# Altium schematic sheet WX0.010.982DL(1).SchDoc
size A3
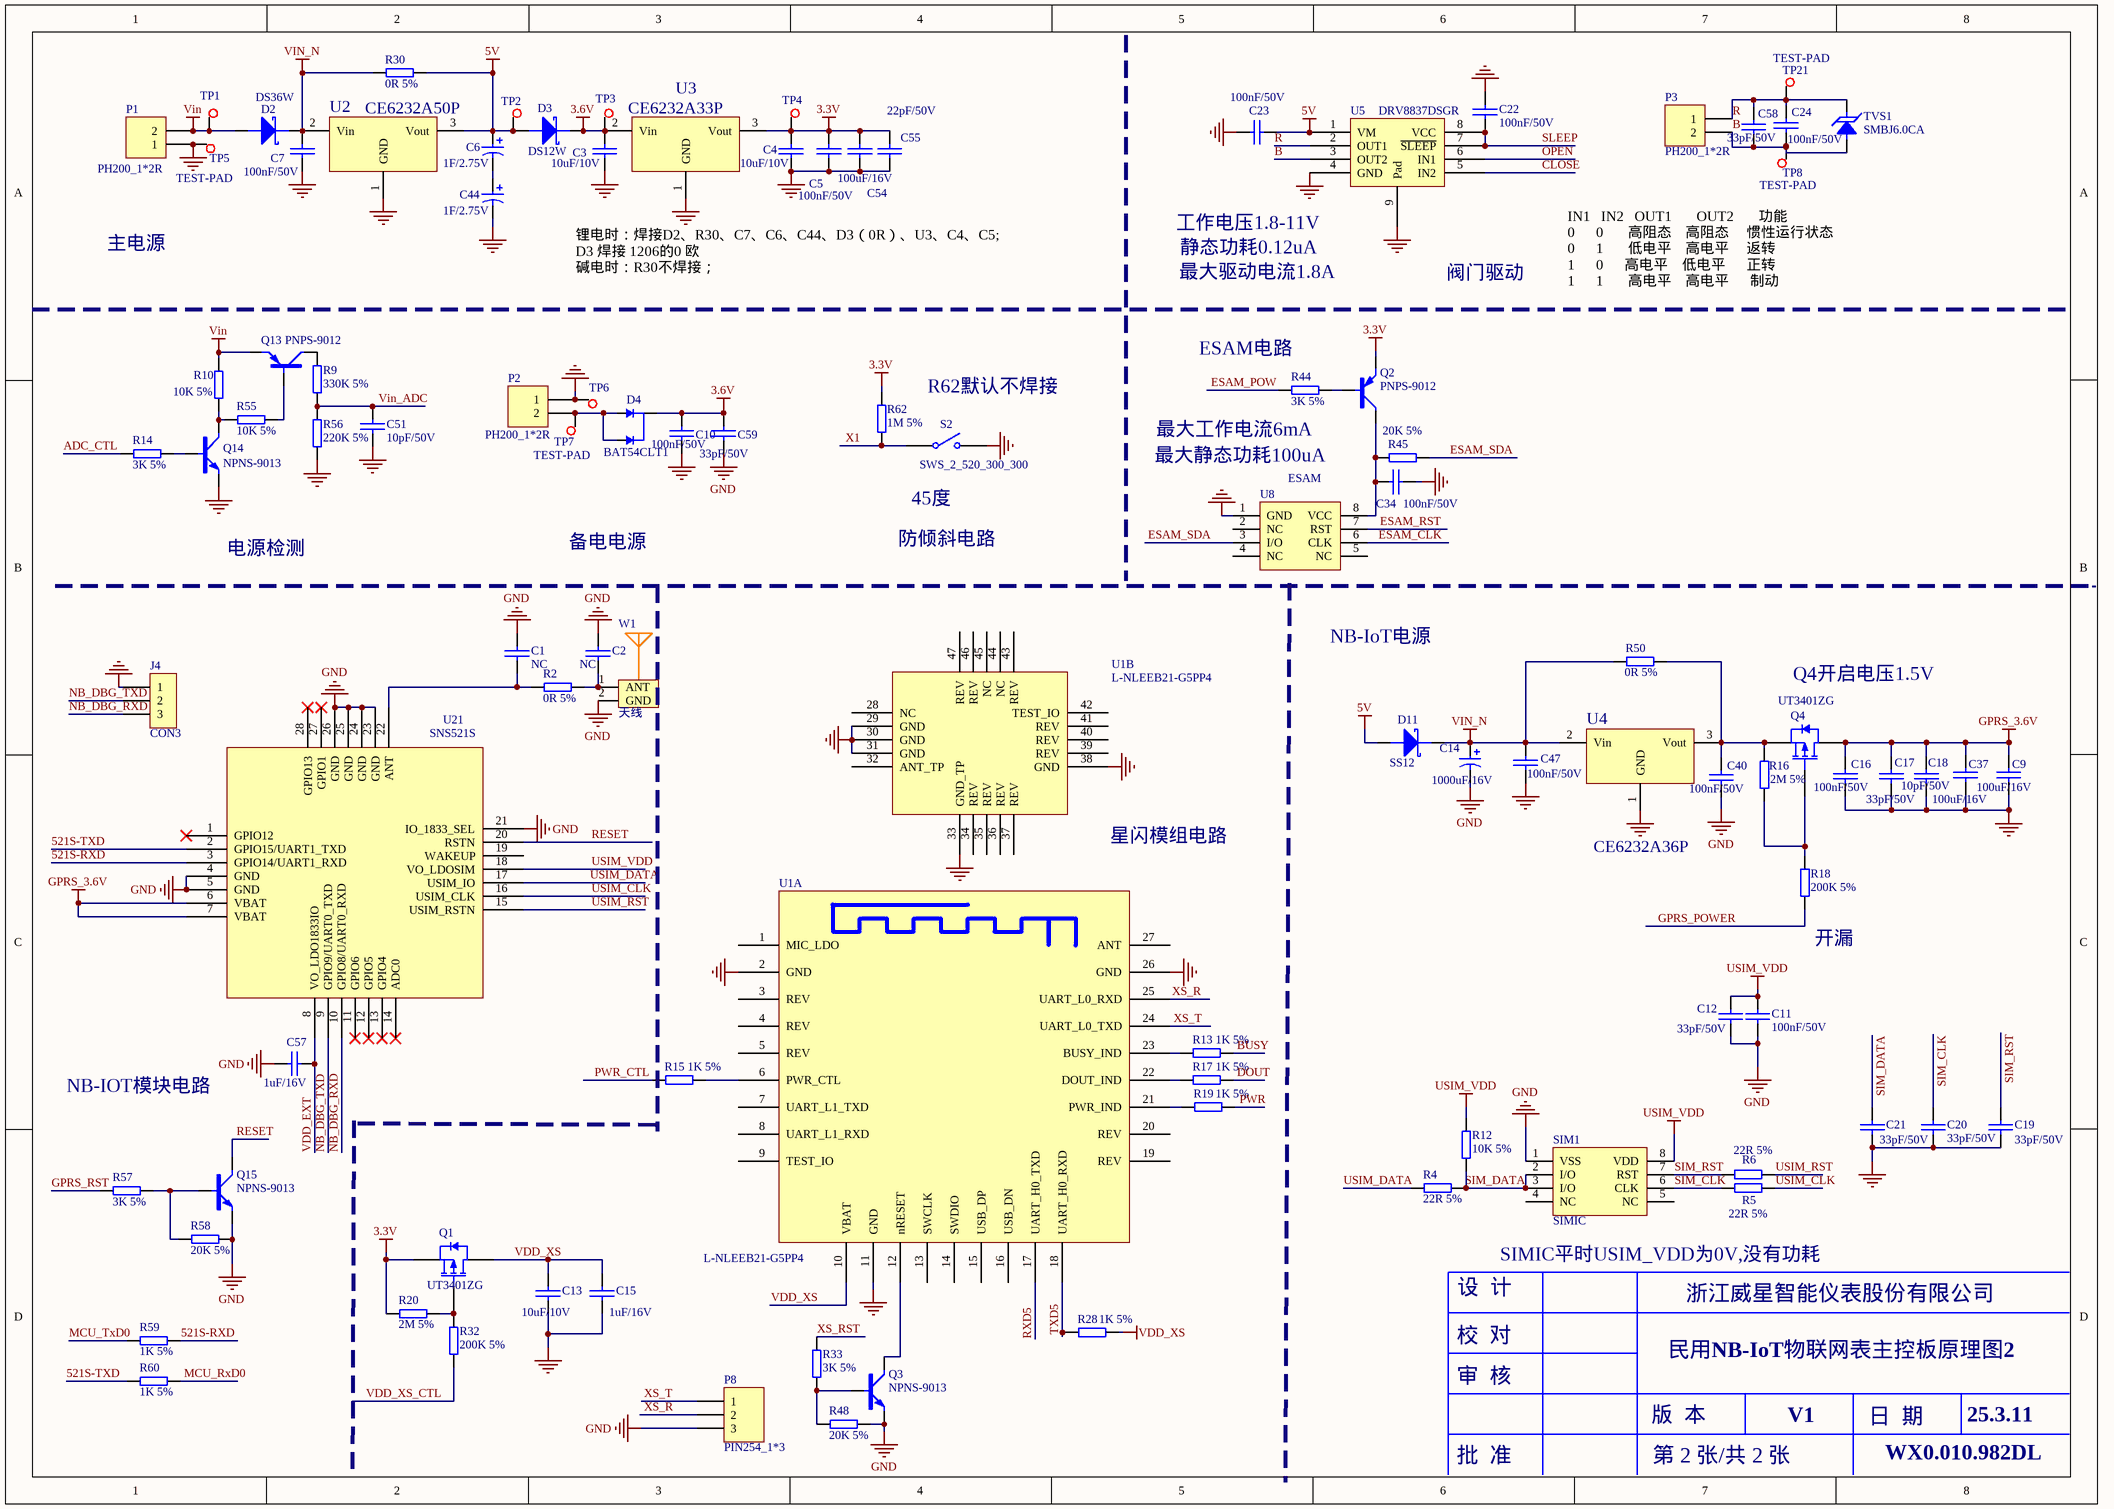
[diagram p0: WX0.010.982DL(1).SchDoc]

## Parts
C1  NC  [CAP0603]
C2  NC  [CAP0603]
C3  10uF/10V  [CAP0603]
C4  10uF/10V  [CAP0603]
C5  100nF/50V  [CAP0603]
C6  1F/2.75V  [CAPPC_350_800_1600R]
C7  100nF/50V  [CAP0603]
C9  100uF/16V  [GRM31CR60J107ME39L]
C10  100nF/50V  [CAP0603]
C11  100nF/50V  [CAP0603]
C12  33pF/50V  [CAP0603]
C13  10uF/10V  [CAP0603]
C14  1000uF/16V  [CAPPC_500_800_2000R]
C15  1uF/16V  [CAP0603]
C16  100nF/50V  [CAP0603]
C17  33pF/50V  [CAP0603]
C18  10pF/50V  [CAP0603]
C19  33pF/50V  [CAP0603]
C20  33pF/50V  [CAP0603]
C21  33pF/50V  [CAP0603]
C22  100nF/50V  [CAP0603]
C23  100nF/50V  [CAP0603]
C24  100nF/50V  [CAP0603]
C34  100nF/50V  [CAP0603]
C37  100uF/16V  [GRM31CR60J107ME39L]
C40  100nF/50V  [CAP0603]
C44  1F/2.75V  [CAPPC_350_800_1600R]
C47  100nF/50V  [CAP0603]
C51  10pF/50V  [CAP0603]
C54  100uF/16V  [GRM31CR60J107ME39L]
C55  22pF/50V  [CAP0603]
C57  1uF/16V  [CAP0603]
C58  33pF/50V  [CAP0603]
C59  33pF/50V  [CAP0603]
D2  DS36W  [SOD-123FL]
D3  DS12W  [SOD-123FL]
D4  BAT54CLT1  [SOT-23]
D11  SS12  [DO-214AC]
J4  CON3  [PIN254_1*3*WXHJ]
P1  PH200_1*2R
P2  PH200_1*2R
P3  PH200_1*2R  [PH200_1*2R]
P8  PIN254_1*3  [PIN254_1*3*WXHJ]
Q1  UT3401ZG  [SOT-23]
Q2  PNPS-9012  [SOT-23]
Q3  NPNS-9013  [SOT-23]
Q4  UT3401ZG  [SOT-23]
Q13  PNPS-9012  [SOT-23]
Q14  NPNS-9013  [SOT-23]
Q15  NPNS-9013  [SOT-23]
R2  0R 5%  [RES0603]
R4  22R 5%  [RES0603]
R5  22R 5%  [RES0603]
R6  22R 5%  [RES0603]
R9  330K 5%  [RES0603]
R10  10K 5%  [RES0603]
R12  10K 5%  [RES0603]
R13  1K 5%  [RES0603]
R14  3K 5%  [RES0603]
R15  1K 5%  [RES0603]
R16  2M 5%  [RES0603]
R17  1K 5%  [RES0603]
R18  200K 5%  [RES0603]
R19  1K 5%  [RES0603]
R20  2M 5%  [RES0603]
R28  1K 5%  [RES0603]
R30  0R 5%  [RES1206]
R32  200K 5%  [RES0603]
R33  3K 5%  [RES0603]
R44  3K 5%  [RES0603]
R45  20K 5%  [RES0603]
R48  20K 5%  [RES0603]
R50  0R 5%  [RES1206]
R55  10K 5%  [RES0603]
R56  220K 5%  [RES0603]
R57  3K 5%  [RES0603]
R58  20K 5%  [RES0603]
R59  1K 5%  [RES0603]
R60  1K 5%  [RES0603]
R62  1M 5%  [RES0603]
S2  SWS_2_520_300_300  [SWS_2_520_300]
SIM1  SIMIC  [SIMIC]
TP1  TEST-PAD  [TEST-PAD]  (value not drawn)
TP2  TEST-PAD  [TEST-PAD]  (value not drawn)
TP3  TEST-PAD  [TEST-PAD]  (value not drawn)
TP4  TEST-PAD  [TEST-PAD]  (value not drawn)
TP5  TEST-PAD  [TEST-PAD]
TP6  TEST-PAD  [TEST-PAD]  (value not drawn)
TP7  TEST-PAD  [TEST-PAD]
TP8  TEST-PAD  [TEST-PAD]
TP21  TEST-PAD  [TEST-PAD]
TVS1  SMBJ6.0CA  [DO-214AA]
U1  L-NLEEB21-G5PP4  [L-NLEEB21-G5BP4]  (parts A,B of 2)
U2  CE6232A50P  [SOT-89]
U3  CE6232A33P  [SOT-89]
U4  CE6232A36P  [SOT-89]
U5  DRV8837DSGR  [S-PWSON-N8]
U8  ESAM  [SOP-8]
U21  SNS521S
W1  天线  [ANT-IPEX_1]

## Nets
3.3V: C4.1 C5.1 C54.1 C55.1 Q1.2(S) Q2.2(E) R20.1 R62.2 TP4.1 U3.3(Vout)
3.6V: C3.1 C10.1 C59.1 D3.2 D4.3(C) TP3.1 U3.2(Vin)
5V: C6.1 C23.2 D3.1 D11.1 R30.2 TP2.1 U2.3(Vout) U5.1(VM)
GND: C1.2 C2.2 C3.2 C4.2 C5.2 C7.2 C9.2 C10.2 C11.2 C12.2 C13.2 C14.2 C15.2 C16.2 C17.2 C18.2 C19.2 C20.2 C21.2 C22.1 C23.1 C34.2 C37.2 C40.2 C44.2 C47.2 C51.1 C54.2 C55.2 C57.2 C59.2 J4.1 P1.1 P2.1 P8.3 Q3.2(E) Q14.2(E) Q15.2(E) R48.2 R56.2 R58.2 S2.2 SIM1.1(VSS) TP5.1 TP6.1 U1.2(GND) U1.11(GND) U1.26(GND) U1.29(GND) U1.30(GND) U1.31(GND) U1.33(GND_TP) U1.38(GND) U2.1(GND) U3.1(GND) U4.1(GND) U5.4(GND) U5.9(Pad) U8.1(GND) U21.4(GND) U21.5(GND) U21.21(IO_1833_SEL) U21.23(GND) U21.24(GND) U21.25(GND) U21.26(GND) W1.2(GND)
GPRS_3.6V: C9.1 C16.1 C17.1 C18.1 C37.1 Q4.3(D) U21.6(VBAT) U21.7(VBAT)
USIM_VDD: C11.1 C12.1 R12.2 SIM1.8(VDD) U21.18(VO_LDOSIM)
VDD_XS: C13.1 C15.1 Q1.3(D) R28.1 U1.10(VBAT)
Vin: D2.1 P1.2 Q13.2(E) R10.2 TP1.1
VIN_N: C7.1 C14.1 C47.1 D2.2 D11.2 R30.1 R50.1 U2.2(Vin) U4.2(Vin)
521S-RXD: R59.1 U21.3(GPIO14/UART1_RXD)
521S-TXD: R60.2 U21.2(GPIO15/UART1_TXD)
ADC_CTL: R14.1
B: C24.2 C58.2 P3.2 TP8.1 TVS1.1 U5.3(OUT2)
BUSY: R13.1
CLOSE: U5.5(IN2)
DOUT: R17.1
ESAM_CLK: U8.6(CLK)
ESAM_POW: R44.1
ESAM_RST: U8.7(RST)
ESAM_SDA: R45.2 U8.3(I/O)
GPRS_POWER: R18.1
GPRS_RST: R57.1
MCU_RxD0: R60.1
MCU_TxD0: R59.2
NB_DBG_RXD: J4.3 U21.10(GPIO8/UART0_RXD)
NB_DBG_TXD: J4.2 U21.9(GPIO9/UART0_TXD)
OPEN: U5.6(IN1)
PWR: R19.1
PWR_CTL: R15.2
R: C24.1 C58.1 P3.1 TP21.1 TVS1.2 U5.2(OUT1)
RESET: Q15.3(C) U21.20(RSTN)
RXD5: U1.17(UART_H0_TXD)
SIM_CLK: C20.1 R5.1 SIM1.6(CLK)
SIM_DATA: C21.1 R4.2 R12.1 SIM1.2(I/O) SIM1.3(I/O)
SIM_RST: C19.1 R6.1 SIM1.7(RST)
SLEEP: C22.2 U5.7(~{SLEEP}) U5.8(VCC)
TXD5: R28.2 U1.18(UART_H0_RXD)
USIM_CLK: R5.2 U21.16(USIM_CLK)
USIM_DATA: R4.1 U21.17(USIM_IO)
USIM_RST: R6.2 U21.15(USIM_RSTN)
VDD_EXT: C57.1 U21.8(VO_LDO1833IO)
VDD_XS_CTL: R32.1
Vin_ADC: C51.2 R9.2 R56.1
X1: R62.1 S2.1
XS_R: P8.2 U1.25(UART_L0_RXD)
XS_RST: R33.1
XS_T: P8.1 U1.24(UART_L0_TXD)
NetC1_1: C1.1 R2.2 U21.22(ANT)
NetC2_1: C2.1 R2.1 W1.1(ANT)
NetC6_2: C6.2 C44.1
NetC34_1: C34.1 Q2.3(C) R45.1 U8.8(VCC)
NetC40_1: C40.1 Q4.2(S) R16.2 R50.2 U4.3(Vout)
NetD4_1: D4.1(A) D4.2(A) P2.2 TP7.1
NetQ1_1: Q1.1(G) R20.2 R32.2
NetQ2_1: Q2.1(B) R44.2
NetQ3_1: Q3.1(B) R33.2 R48.1
NetQ3_3: Q3.3(C) U1.12(nRESET)
NetQ4_1: Q4.1(G) R16.1 R18.2
NetQ13_1: Q13.1(B) R55.2
NetQ13_3: Q13.3(C) R9.1
NetQ14_1: Q14.1(B) R14.2
NetQ14_3: Q14.3(C) R10.1 R55.1
NetQ15_1: Q15.1(B) R57.2 R58.1
NetR13_2: R13.2 U1.23(BUSY_IND)
NetR15_1: R15.1 U1.6(PWR_CTL)
NetR17_2: R17.2 U1.22(DOUT_IND)
NetR19_2: R19.2 U1.21(PWR_IND)

Not connected (* = marked no-connect by the designer): SIM1 4(NC) 5(NC); U1 1(MIC_LDO) 3(REV) 4(REV) 5(REV) 7(UART_L1_TXD) 8(UART_L1_RXD) 9(TEST_IO) 13(SWCLK) 14(SWDIO) 15(USB_DP) 16(USB_DN) 19(REV) 20(REV) 27(ANT) 28(NC) 32(ANT_TP) 34(REV) 35(REV) 36(REV) 37(REV) 39(REV) 40(REV) 41(REV) 42(TEST_IO) 43(REV) 44(NC) 45(NC) 46(REV) 47(REV); U8 2(NC) 4(NC) 5(NC); U21 1(GPIO12)* 11(GPIO6)* 12(GPIO5)* 13(GPIO4)* 14(ADC0)* 19(WAKEUP) 27(GPIO1)* 28(GPIO13)*

## Notes on the sheet
- 工作电压1.8-11V
- 主电源
- 锂电时：焊接D2、R30、C7、C6、C44、D3（0R）、U3、C4、C5; D3 焊接 1206的0 欧
  碱电时：R30不焊接；
- 最大驱动电流1.8A
- 静态功耗0.12uA
- 阀门驱动
- IN1   IN2   OUT1       OUT2       功能
  0      0       高阻态    高阻态     惯性运行状态
  0      1       低电平    高电平     返转
  1      0      高电平    低电平      正转
  1      1       高电平    高电平      制动
- (near R44) ESAM电路
- R62默认不焊接
- 最大工作电流6mA
- 45度
- 最大静态功耗100uA
- 电源检测
- 备电电源
- 防倾斜电路
- NB-IoT电源
- Q4开启电压1.5V
- (near U1) 星闪模组电路
- (near R18) 开漏
- NB-IOT模块电路
- SIMIC平时USIM_VDD为0V,没有功耗
- 设  计
- 浙江威星智能仪表股份有限公司
- 审  核
- 校  对
- 民用NB-IoT物联网表主控板原理图2
- 批  准
- 版  本
- 第 2 张/共 2 张
- V1
- 日  期
- WX0.010.982DL
- 25.3.11

## Library data of the parts
C1 C2 = 101020103-0005: Part Name: 0603贴片电容; ID: 11; SMD/DIP: SMD
C3 C4 C13 = 101020103-0026: 106pF,10 V,±10%,0603,村田,GRM188R61A106KE47D; Part Name: 0603贴片电容; ID: 8; SMD/DIP: SMD; Part Number: 101020103-0026
C5 C7 C10 C11 C16 C22-C24 C34 C40 C47 C58 C59 = 101020103-0021: 104pF,50 V,±10%,0603,国巨,CC0603KRX7R9BB104; Part Name: 0603贴片电容; ID: 3; SMD/DIP: SMD; Part Number: 101020103-0021
C6 C44 = 1010202-0015: 1F,2.75 V,-20%~+20%,8mm*16mm,红宝石,2.7 DMC 1 M MY4 8X16; Part Name: 法拉电容; ID: 12; SMD/DIP: DIP; Part Number: 1010202-0015
C9 C37 = 101020101-0005: Part Name: 1206贴片电容; ID: 9; SMD/DIP: SMD
C12 C17 C19-C21 = 101020103-0027: 33pF,50 V,±10%,0603,国巨,CC0603KRNPO9BN33; Part Name: 0603贴片电容; ID: 18; SMD/DIP: SMD; Part Number: 101020103-0027
C14 = 1010203-0029: 1000UF,16V,±20%,贴片10*10.2MM,深圳市三炎科电子科技有限公司,16V1000UF; Part Number: 1010203-0026; Part Name: 电解电容; ID: 2; SMD/DIP: DIP
C15 C57 = 101020103-0003: 105pF,16 V,±10%,0603,国巨,CC0603KRX7R7BB105; Part Name: 0603贴片电容; ID: 14; SMD/DIP: SMD; Part Number: 101020103-0003
C18 C51 = 101020103-0014: 10pF,50 V,±5%,0603,X7R,国巨,CC0603JRNPO9BN100; Part Name: 0603贴片电容; ID: 7; SMD/DIP: SMD; Part Number: 101020103-0014
C54 = 101020101-0005: 100u,16 V,±10%,1206,国巨,CC1206KRNPO7BN106P; Part Name: 1206贴片电容; ID: 9; SMD/DIP: SMD
C55 = 101020103-0009: 22pF,50 V,±5%,0603,国巨,CC0603JRNPO9BN22; Part Name: 0603贴片电容; ID: 16; SMD/DIP: SMD; Part Number: 101020103-0009
D2 = 101040101-0048: DS36W,SOD123-FL,3 A,42 V,60 V,浙江领晨科技有限公司,DS36W; Part Number: 101040101-0055; Part Name: 贴片肖特基; ID: 8; SMD/DIP: SMD
D3 = 101040101-0048: DS12W,SOD-123FL,1 A,0.55 V,20 V,领晨科技,DS12W; Part Name: 贴片肖特基; ID: 9; SMD/DIP: SMD; Part Number: 101040101-0048
D4 = 101040101-0038: BAT54CLT1，SOT23-3,SOT23-3,0.2 A,0.8 V,30 V,安森美,BAT54CLT1; Part Name: 贴片肖特基; ID: 31; SMD/DIP: SMD; Part Number: 101040101-0038
D11 = 101040101-0009: SS12,DO-214AC,1 A,0.55 V,20 V,昶鑫,SS12; Part Name: 贴片肖特基; ID: 13; SMD/DIP: SMD; Part Number: 101040101-0009
J4 = CON3: Connector
P1-P3 = 1010902-0105: 2.0-2AW,直插弯座，2PIN，脚间距2mm，带防翘起,公头,单排,2.0-2AW;直插弯座，2PIN,脚间距2mm，带防翘起; Part Name: PH座; ID: 11; SMD/DIP: DIP; Part Number: 1010902-0105
Q1 Q4 = 101040201-0013: UT3401ZG,P-MOS,SOT-23,UTC,UT3401ZG; Part Name: 功率MOS管; ID: 18; SMD/DIP: SMD; Part Number: 101040201-0013
Q2 = 101040201-0001: 9012,PNP,SOT-23,JCET;长电,S9012; Part Name: 贴片三极管; ID: 16; SMD/DIP: SMD; Part Number: 101040201-0001
Q3 Q14 Q15 = 101040201-0002: 9013,NPN,SOT-23,长电,S9013; Part Name: 贴片三极管; ID: 15; SMD/DIP: SMD; Part Number: 101040201-0002
Q13 = 101040201-0001: 9012,PNP,SOT-23,JCET;长电,S9012; Part Name: 贴片三极管; ID: 17; SMD/DIP: SMD; Part Number: 101040201-0001
R2 = 101010103-0001: 国巨,±5%,0603,,155 ℃,-55 ℃,RC0603J2-070RL,无铅,200 ppm/℃,1/10W,,0R; Part Name: 0603贴片电阻; ID: 1; SMD/DIP: SMD; Part Number: 101010103-0001
R4-R6 R12 = 101010103-0009: 国巨,±5%,0603,,155 ℃,-55 ℃,RC0603JR-0722RL,无铅,200 ppm/℃,1/10W,,22欧; Part Name: 0603贴片电阻; ID: 17; SMD/DIP: SMD; Part Number: 101010103-0009
R9 = 101010103-0066: 330K,±5%,1/10W,0603,国巨,RC0603JR-07330KL; Part Name: 0603贴片电阻; ID: 31; SMD/DIP: SMD; Part Number: 101010103-0066
R10 R44 R55 = 101010103-0003: 国巨,±5%,0603,,155 ℃,-55 ℃,RC0603JR-0710KL,无铅,200 ppm/℃,1/10W,,10K; Part Name: 0603贴片电阻; ID: 7; SMD/DIP: SMD; Part Number: 101010103-0003
R13 R15 R17 R19 R28 R60 = 101010103-0008: 1K,±5%,1/10W,0603,国巨,RC0603JR-071KL; Part Name: 0603贴片电阻; ID: 10; SMD/DIP: SMD; Part Number: 101010103-0008
R14 R33 R57 = 101010103-0006: 国巨,±5%,0603,,155 ℃,-55 ℃,RC0603JR-073KL,无铅,100 ppm/℃,1/10W,,3K; Part Name: 0603贴片电阻; ID: 23; SMD/DIP: SMD; Part Number: 101010103-0006
R16 = 101010103-0025: 国巨,±5%,0603,,155 ℃,-55 ℃,RC0603JR-072ML,含铅,100 ppm/℃,1/10W,,2M; Part Name: 0603贴片电阻; ID: 20; SMD/DIP: SMD; Part Number: 101010103-0025
R18 = 101010103-0034: 200K,±5%,1/10W,0603,国巨,RC0603JR-07200KL; Part Name: 0603贴片电阻; ID: 13; SMD/DIP: SMD; Part Number: 101010103-0034
R20 R32 = 101010103-0003: 10K±5%,1/10W,0603; Part Name: 0603贴片电阻; ID: 32; Part Number: 101010103-0003
R30 R50 = 101010101-0013: 0Ω,±5%,1/4W,1206,国巨,RC1206JR-070RL; Part Name: 1206贴片电阻; ID: 2; SMD/DIP: SMD; Part Number: 101010101-0013
R45 R48 R58 = 101010103-0004: 国巨,±5%,0603,,155 ℃,-55 ℃,RC0603JR-0720KL,无铅,200 ppm/℃,1/10W,,20K; Part Name: 0603贴片电阻; ID: 15; SMD/DIP: SMD; Part Number: 101010103-0004
R56 = 101010103-0044: 220K,±5%,1/10W,0603,国巨,RC0603JR-07220KL; Part Name: 0603贴片电阻; ID: 30; SMD/DIP: SMD; Part Number: 101010103-0044
R59 = 101010103-0042: 4.7K±5%,1/10W,0603; Part Name: 0603贴片电阻; ID: 24; SMD/DIP: SMD; Part Number: 101010103-0042
R62 = 101010103-0002: 国巨,±5%,0603,,155 ℃,-55 ℃,RC0603JR-071ML,无铅,200 ppm/℃,1/10W,,1M; Part Name: 0603贴片电阻; ID: 11; SMD/DIP: SMD; Part Number: 101010103-0002
S2 = 1011001-0041: CSX-SEN-645B,垂直45°开关转换,3*5.2mm,360°任意方位倾斜检测,深圳市成晟科技有限公司; Part Number: 1011001-0051; Part Name: 倾斜开关; ID: 33; SMD/DIP: SMD
SIM1 = AD_XN_SIMIC_01: SIMIC虚拟器件; ID: 20; SMD/DIP: SMD; Part Number: AD_XN_SIMIC_01; Part Name: SIMIC
TP1-TP8 TP21 = AD_WXHJ_TEST-PAD_01: 单面焊盘测试点; Part Name: 测试点; ID: 23; SMD/DIP: SMD; Part Number: AD_WXHJ_TEST-PAD_01
TVS1 = 101040101-0024: SMBJ6.0CA,DO-214AA,10.3 V,6.0 V,600 W,58.3 A,800 uA,上海君耀电子有限公司,SMBJ6.0CA; Part Name: TVS管; ID: 23; SMD/DIP: SMD; Part Number: 101040101-0024
U1 = L-NLEEB21-G5BP4
U2 = 1010503-0013: S-1206B50-U3,S-1206B50-U3,SOT89-3,6.5 V,1.7 V,0.2 V,5 V,250mA@VIN≧VOUT(S)＋1.0 V﹐1.5 V≦VOUT(S),1 uA,精工电子; Part Name: 贴片稳压器; ID: 6; SMD/DIP: SMD; Part Number: 1010503-0013
U3 = 1010503-0002: S-1206B33-U3T1G,S-1206B33-U3T1G,SOT89-3,6.5 V,1.7 V,0.15 V,3.3 V,250mA@VIN≧VOUT(S)＋1.0 V﹐1.5 V≦VOUT(S),1 uA,精工电子; Part Name: 线性稳压芯片; ID: 5; SMD/DIP: SMD; Part Number: 1010503-0002
U4 = 1010503-0031: CE6232A36P,CE6232A36P,SOT89-3,8 V,1.8 V,0.11 V,3.6 V,600mA,0.8 uA,南京芯力微电子有限公司; Part Name: 贴片稳压器; ID: 30; SMD/DIP: SMD; Part Number: 1010503-0031
U5 = 101050101-0060: DRV8837DSGR,S-PWSON-N8,TI,DRV8837DSGR; Part Name: 驱动芯片; ID: 23; SMD/DIP: SMD; Part Number: 101050101-0060
U8 = AD_XN_ESAM_01: ESAM虚拟器件; Part Name: ESAM芯片; ID: 11; SMD/DIP: SMD; Part Number: AD_XN_ESAM_01
U21 = OUT
W1 = 1010902-0145: UB06000058A,3*3.1*1.25mm,公头,单排,IPEX一代板端; Part Name: IPEX座; ID: 31; SMD/DIP: SMD; Part Number: 1010902-0145